# EAGLE design esp-wifisensor (EAGLE 7.5.0)
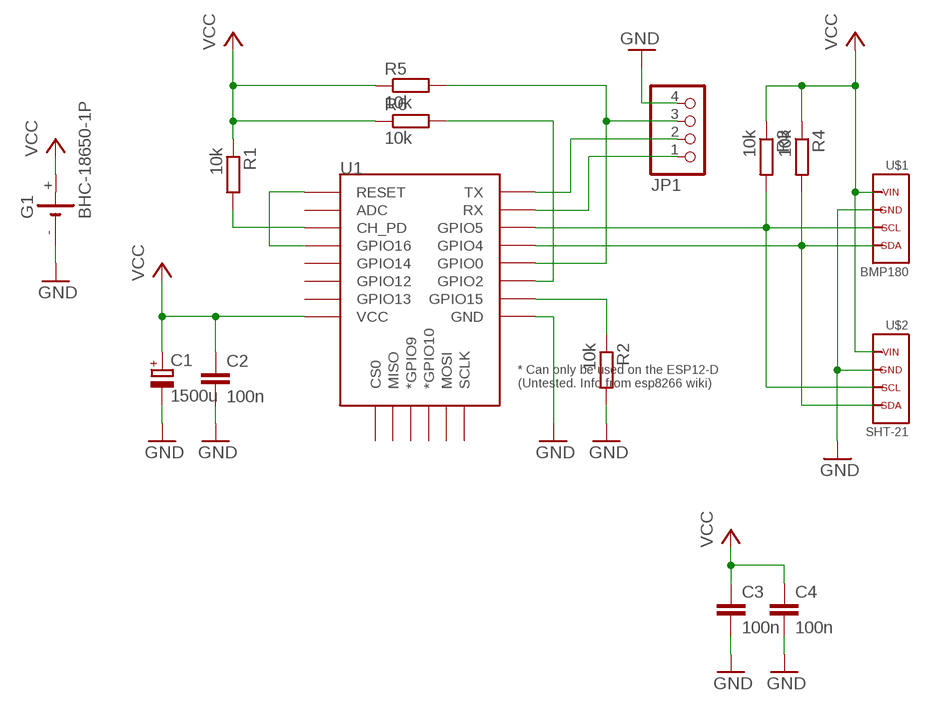
[diagram p0: schematic, sheet 1]

## Parts
C1  1500u  CPOL-EUE5-13  [E5-13]
C2  100n  C-EUC1206K  [C1206K]
C3  100n  C-EUC1206K  [C1206K]
C4  100n  C-EUC1206K  [C1206K]
G1  BHC-18650-1P  [BHC-18650-1P]
JP1  PINHD-1X4  [1X04]
R1  10k  R-EU_M1206  [M1206]
R2  10k  R-EU_M1206  [M1206]
R3  10k  R-EU_M1206  [M1206]
R4  10k  R-EU_M1206  [M1206]
R5  10k  R-EU_M1206  [M1206]
R6  10k  R-EU_M1206  [M1206]
U1  ESP12ESMD  [ESP12E-SMD]
U$1  BMP180  [BMP180]
U$2  SHT-21  [SHT-21]

## Nets
GND: C1.- C2.2 C3.2 C4.2 G1.- JP1.4 R2.2 U1.GND U$1.GND U$2.GND
N$1: U1.GPIO16 U1.RESET
N$2: R3.2 U1.GPIO5 U$1.SCL U$2.SCL
N$3: R4.2 U1.GPIO4 U$1.SDA U$2.SDA
N$4: R2.1 U1.GPIO15
N$5: JP1.3 R5.2 U1.GPIO0
N$6: R1.2 U1.CH_PD
N$7: R6.2 U1.GPIO2
N$8: JP1.2 U1.TXD0(TX)
N$10: JP1.1 U1.RXD0(RX)
VCC: C1.+ C2.1 C3.1 C4.1 G1.+ R1.1 R3.1 R4.1 R5.1 R6.1 U1.VCC U$1.VIN U$2.VIN
Unconnected: U1.ADC U1.CS0 U1.GPIO9(*GPIO9) U1.GPIO10(*GPIO10) U1.GPIO12 U1.GPIO13 U1.GPIO14 U1.MISO U1.MOSI U1.SCLK

## Library data of the parts
C1 = ED1E152MNN1225:CPOL-EU: POLARIZED CAPACITOR, European symbol
C2-C4 = rcl:C-EU: CAPACITOR, European symbol
G1 = BHC-18650-1P:BHC-18650-1P: LiPoFe4 Battery 3.6 V
JP1 = pinhead:PINHD-1X4: PIN HEADER
R1-R6 = rcl:R-EU_: RESISTOR, European symbol
U1 = esp8266modules:ESP12E: ESP12E Module
U$1 = BMP180_module:BMP180
U$2 = SHT-21_module:SHT-21

## Board
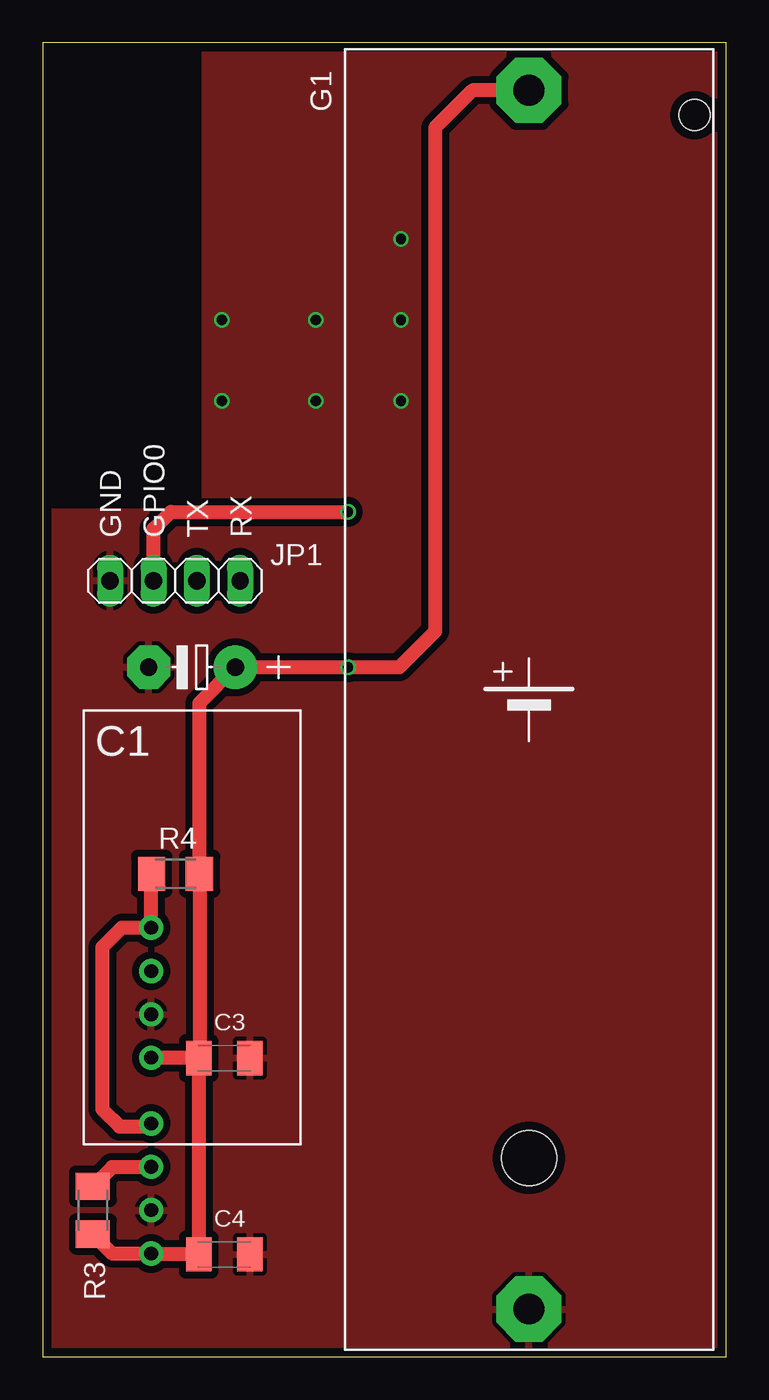
[diagram p1: board, top side]
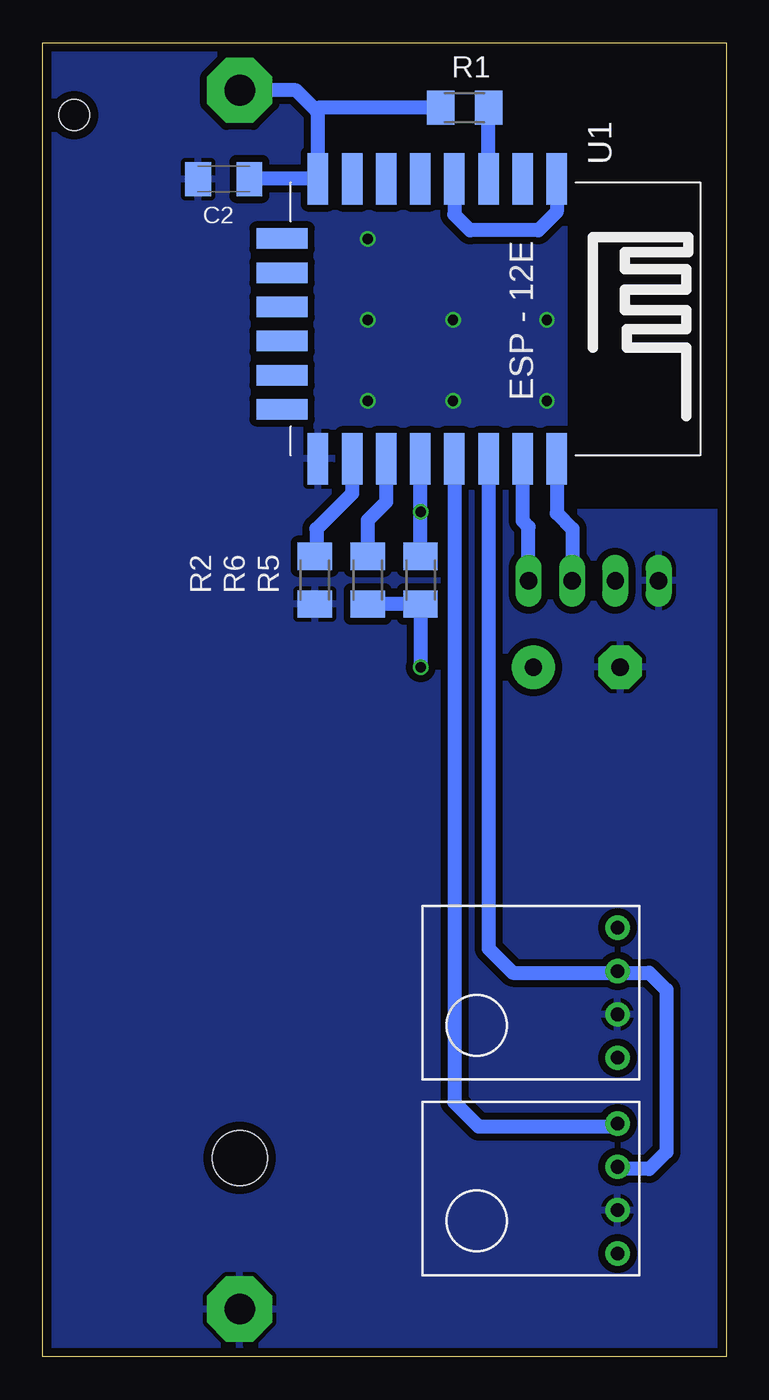
[diagram p2: board, bottom side, seen from below]

Size 40.05 x 76.99 mm. Coordinates in mm from the lower left corner, seen from the top.
Outline: 0,0 40.05,0 40.05,76.99 0,76.99 0,0
Copper layers (1*16): Top 0.035mm / dielectric 1.6mm / Bottom 0.035mm
Design rules "Elecrow_2-layer_PCB_eagle_rule": minimum track width 6mil, minimum drill 12mil, track to track 6mil, track to pad 8mil, pad to pad 12mil, via to via 12mil, smd to smd 0mil, copper to edge 20mil, drill to drill 10mil, minimum pad ring 6mil, minimum via ring 6mil, stop-mask expansion 0mil, vias tented up to drill 100mil, thermal gap 10mil

### Footprints (pad centres in the part's own frame; a part is rotated, then mirrored left to right if it is on the bottom)
E5-13 = drill 1.016 pad 2.54: + -2.54,0 | drill 1.016 pad 2.54 octagon: - 2.54,0
C1206K = smd 1.5 x 2: 1 -1.5,0; 2 1.5,0
BHC-18650-1P = drill 1.8 pad 3.81 octagon: + 35.7,0; - -35.7,0 | hole 1.8: 34.25,-9.7 | hole 3.2: -26.85,0
1X04 = drill 1.016 long: 1 -3.81,0; 2 -1.27,0; 3 1.27,0; 4 3.81,0
M1206 = smd 1.6 x 2: 1 -1.4,0; 2 1.4,0
ESP12E-SMD = smd 3 x 1.2: ADC -8.3,3.8; CH_PD -8.3,1.8; GND 8.1,-8.2; GPIO0 8.1,-2.2; GPIO2 8.1,-4.2; GPIO4 8.1,-0.2; GPIO5 8.1,1.8; GPIO12 -8.3,-4.2; GPIO13 -8.3,-6.2; GPIO14 -8.3,-2.2; GPIO15 8.1,-6.2; GPIO16 -8.3,-0.2; RESET -8.3,5.8; RXD0 8.1,3.8; TXD0 8.1,5.8; VCC -8.3,-8.2 | smd 1.2 x 3: CS0 -4.8,-10.3; GPIO9 -0.8,-10.3; GPIO10 1.2,-10.3; MISO -2.8,-10.3; MOSI 3.2,-10.3; SCLK 5.2,-10.3
BMP180 = drill 0.8 pad 1.422: GND -1.27,0; SCL 1.27,0; SDA 3.81,0; VIN -3.81,0
SHT-21 = drill 0.8 pad 1.422: GND -1.27,0; SCL 1.27,0; SDA 3.81,0; VIN -3.81,0

### Placement (x,y rotation side)
C1  8.75,40.4 180 top
C2  29.44,69 180 bottom
C3  10.65,17.5 0 top
C4  10.65,6 0 top
G1  28.5,38.5 90 top
JP1  7.76,45.47 180 top
R1  15.32,73.18 0 bottom
R2  24.1,45.5 270 bottom
R3  2.94,8.59 90 top
R4  7.79,28.3 180 top
R5  17.9,45.5 90 bottom
R6  21,45.5 90 bottom
U1  15.72,60.71 270 bottom
U$1  6.36,21.33 90 bottom
U$2  6.36,9.86 90 bottom

### Tracks (layer width: path | path; a pad name or v marks a point on that pad's centre or on a via)
GND  (via drill 0.6)
  other vias: 21,60.75 10.5,60.75 21,56 21,65.5 10.5,56 16,56 16,60.75
  pour Bottom (isolate 0.406): 40,77 9.5,77 9.5,49.5 0,49.5 0,0 40,0
  pour Top (isolate 0.406): 0,49.5 0,0 40,0 40,77 9.5,77 9.5,49.5
N$1
  Bottom 0.813: U1.GPIO16 15.92,66.92 15,66 11,66 9.92,67.08 U1.RESET
N$2  (via drill 0.6)
  Top 0.813: v6.34,11.11 4.06,11.11 R3.2
  Bottom 0.813: U1.GPIO5 13.92,23.92 12.5,22.5 6.46,22.5 | 6.46,22.5 U$1.SCL | 6.46,22.5 4.5,22.5 3.5,21.5 3.5,12 4.5,11 6.23,11 v6.34,11.11 U$2.SCL
N$3
  Top 0.813: U$2.SDA 6.19,13.5 4.5,13.5 3.5,14.5 3.5,24 4.64,25.14 U$1.SDA 6.36,28.27 R4.2
  Bottom 0.813: U1.GPIO4 15.92,14.92 14.5,13.5 6.53,13.5 U$2.SDA
N$4
  Bottom 0.813: U1.GPIO15 21.92,50.58 24,48.5 24,46.97 R2.1
N$5  (via drill 0.6)
  Top 0.813: JP1.3 6.5,45.98 6.5,48.5 7.5,49.5 v17.9,49.5
  Bottom 0.813: 18,52.53 U1.GPIO0 17.9,52.59 v17.9,49.5 R5.2
N$6
  Bottom 0.813: U1.CH_PD R1.2
N$7
  Bottom 0.813: U1.GPIO2 19.92,50.08 21,49 R6.2
N$8
  Bottom 0.813: U1.TXD0 9.92,49.42 9,48.5 9,46 JP1.2
N$10
  Bottom 0.813: 12,52.39 arc-90 12.07,52.46 U1.RXD0 11.92,48.97 11.57,48.62 JP1.1
VCC  (via drill 0.6)
  Top 0.813: G1.+ 25.2,74.2 23,72 23,42.5 20.9,40.4 v17.9,40.4 C1.+ 9.19,38.3 R4.1 9.19,17.5 C3.1 | C3.1 6.38,17.5 U$1.VIN | C3.1 C4.1 6.41,6 U$2.VIN 4.08,6.05 R3.1
  Bottom 0.813: 28.48,74.18 G1.+ 25.2,74.2 24,73 | v17.9,40.4 R5.1 R6.1 | C2.1 U1.VCC 23.9,69.01 23.9,72.9 24,73 | R1.1 23.82,73.18 24,73

### Text on the board
tPlace: GND | GPIO0 | TX | RX